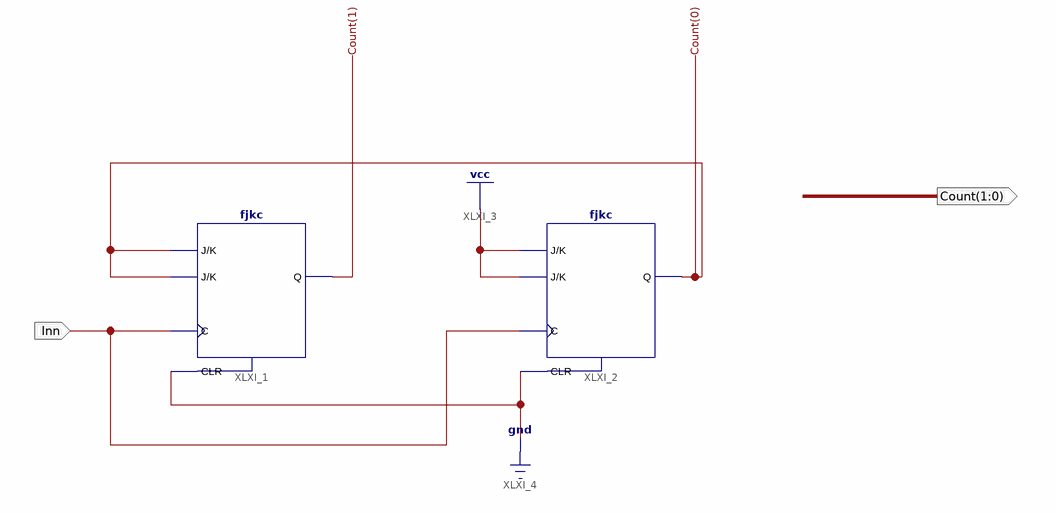
[diagram p0: schematic sheet 1]
// Xilinx ISE schematic Counter0_3.sch (spartan6) as structural Verilog: 2 symbols, 2 ports
module Counter0_3 (
  input  Inn,
  output [1:0] Count
);

  fjkc XLXI_1 (.C(Inn), .CLR(1'b0), .J(Count[0]), .K(Count[0]), .Q(Count[1]));
  fjkc XLXI_2 (.C(Inn), .CLR(1'b0), .J(1'b1), .K(1'b1), .Q(Count[0]));
endmodule
